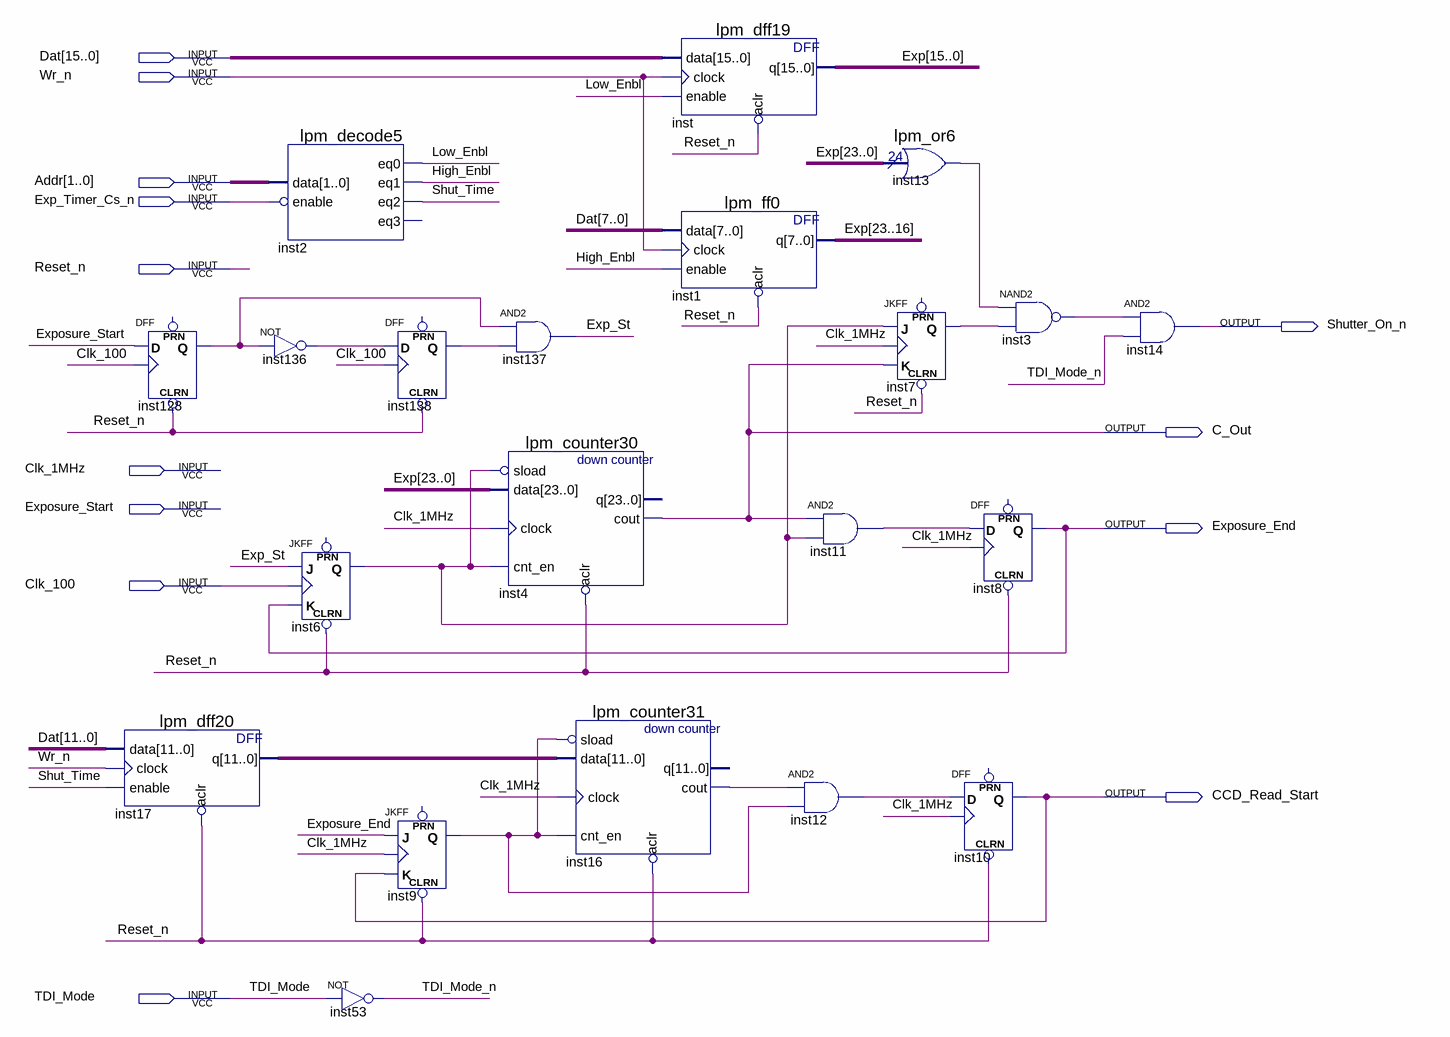
[diagram p0: schematic sheet]
// Quartus schematic Exposure_Control_Module.bdf as structural Verilog: 21 symbols, 13 pins
module Exposure_Control_Module (
  input  [15:0] Dat,
  input  Wr_n,
  input  [1:0] Addr,
  input  Exp_Timer_Cs_n,
  input  Reset_n,
  input  Clk_1MHz,
  input  Exposure_Start,
  input  Clk_100,
  input  TDI_Mode,
  output Shutter_On_n,
  output C_Out,
  output Exposure_End,
  output CCD_Read_Start
);

  wire Exp_St, High_Enbl, inst3_out, inst6_q, inst7_q, inst9_q, inst11_out, inst12_out, inst13_result,
       inst16_cout, inst128_q, inst136_out, inst138_q, Low_Enbl, Shut_Time, TDI_Mode_n;
  wire [11:0] inst17_q;
  wire [23:0] Exp;

  DFF inst128 (.CLRN(Reset_n), .CLK(Clk_100), .D(Exposure_Start), .Q(inst128_q));  // open: PRN
  lpm_dff20 inst17 (.data(Dat[11:0]), .clock(Wr_n), .enable(Shut_Time), .aclr(~Reset_n), .q(inst17_q));
  lpm_decode5 inst2 (
    .data(Addr), .enable(~Exp_Timer_Cs_n), .eq0(Low_Enbl), .eq1(High_Enbl), .eq2(Shut_Time));  // open: eq3
  not inst136 (inst136_out, inst128_q);
  JKFF inst6 (.CLRN(Reset_n), .K(Exposure_End), .J(Exp_St), .CLK(Clk_100), .Q(inst6_q));  // open: PRN
  DFF inst138 (.CLRN(Reset_n), .CLK(Clk_100), .D(inst136_out), .Q(inst138_q));  // open: PRN
  JKFF inst9 (.CLRN(Reset_n), .K(CCD_Read_Start), .J(Exposure_End), .CLK(Clk_1MHz), .Q(inst9_q));  // open: PRN
  not inst53 (TDI_Mode_n, TDI_Mode);
  and inst137 (Exp_St, inst128_q, inst138_q);
  lpm_counter30 inst4 (
    .sload(~inst6_q), .data(Exp), .clock(Clk_1MHz), .cnt_en(inst6_q), .aclr(~Reset_n), .cout(C_Out));  // open: q
  lpm_counter31 inst16 (
    .sload(~inst9_q), .data(inst17_q), .clock(Clk_1MHz), .cnt_en(inst9_q), .aclr(~Reset_n), .cout(inst16_cout));  // open: q
  lpm_dff19 inst (.data(Dat), .clock(Wr_n), .enable(Low_Enbl), .aclr(~Reset_n), .q(Exp[15:0]));
  lpm_ff0 inst1 (.data(Dat[7:0]), .clock(Wr_n), .enable(High_Enbl), .aclr(~Reset_n), .q(Exp[23:16]));
  and inst11 (inst11_out, C_Out, inst6_q);
  and inst12 (inst12_out, inst16_cout, inst9_q);
  lpm_or6 inst13 (.data(Exp), .result(inst13_result));
  JKFF inst7 (.CLRN(Reset_n), .K(C_Out), .J(inst6_q), .CLK(Clk_1MHz), .Q(inst7_q));  // open: PRN
  nand inst3 (inst3_out, inst13_result, inst7_q);
  DFF inst8 (.CLRN(Reset_n), .CLK(Clk_1MHz), .D(inst11_out), .Q(Exposure_End));  // open: PRN
  DFF inst10 (.CLRN(Reset_n), .CLK(Clk_1MHz), .D(inst12_out), .Q(CCD_Read_Start));  // open: PRN
  and inst14 (Shutter_On_n, inst3_out, TDI_Mode_n);
endmodule
